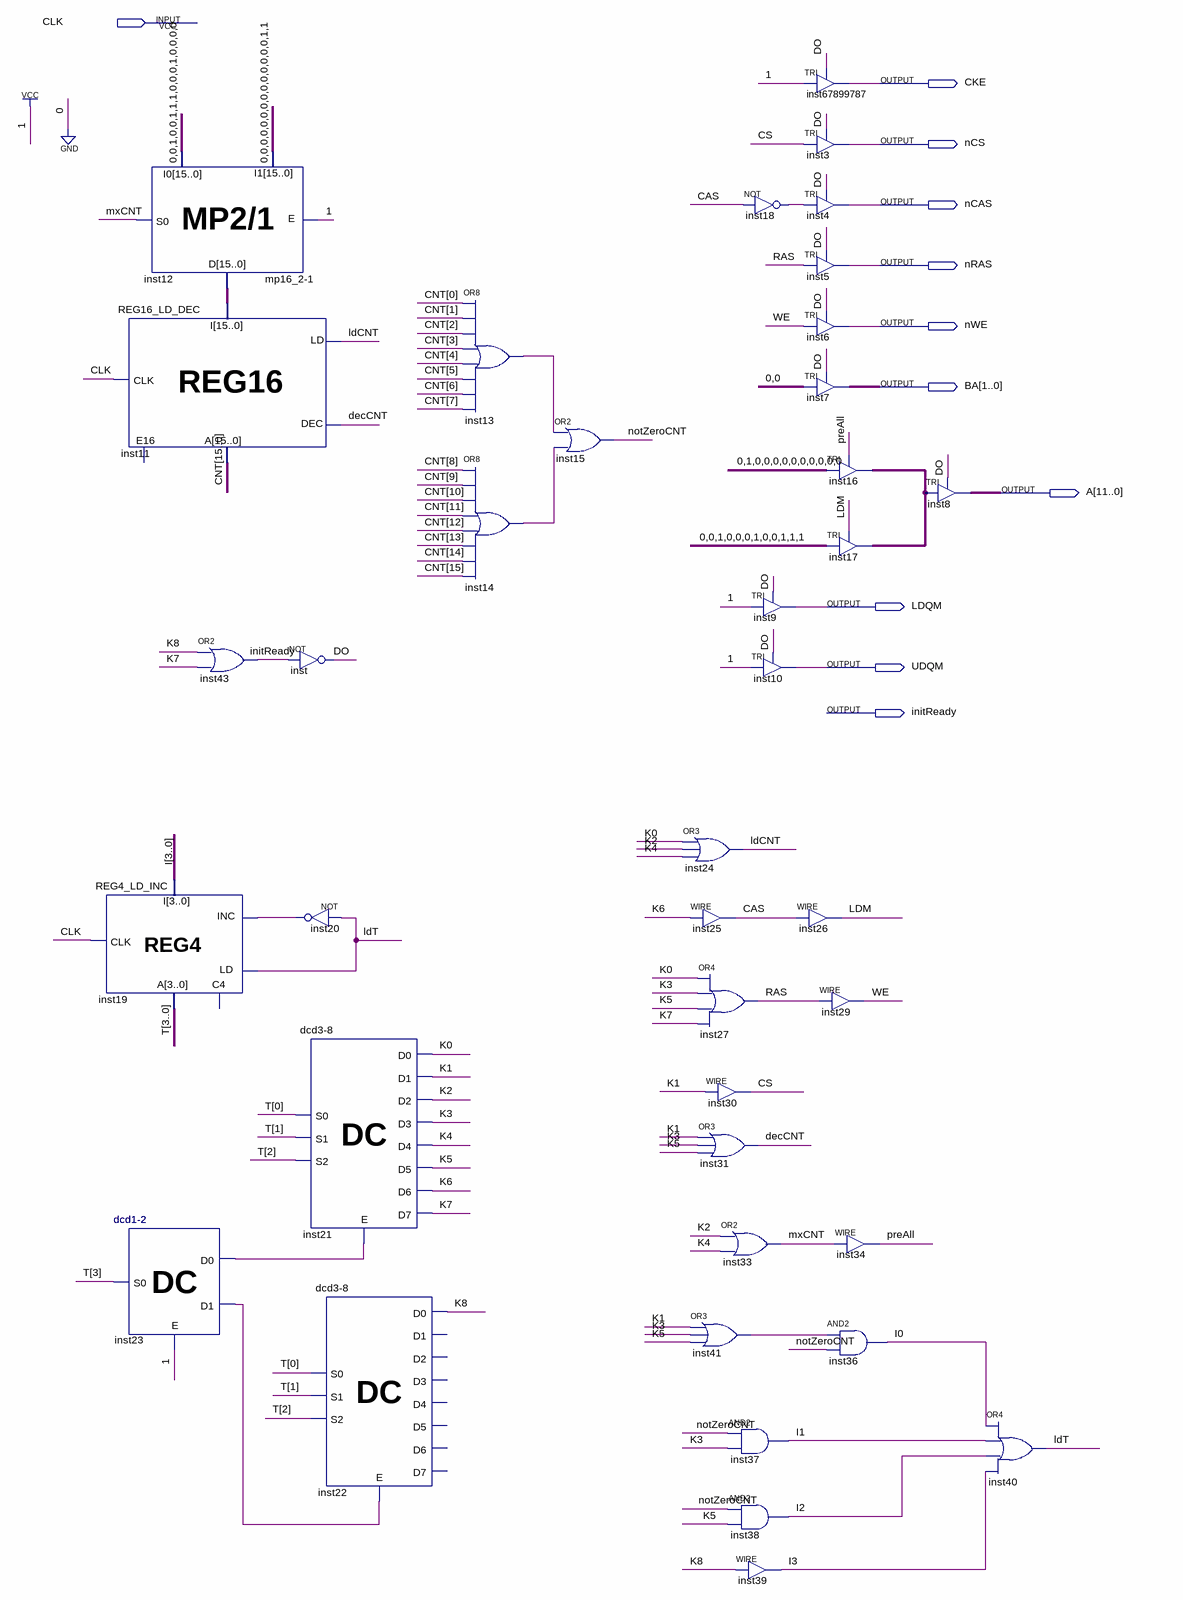
[diagram p0: schematic sheet]
// Quartus schematic GPU_init.bdf as structural Verilog: 39 symbols, 11 pins
module GPU_init (
  input  CLK,
  output CKE,
  output nCS,
  output nCAS,
  output nRAS,
  output nWE,
  output [1:0] BA,
  output [11:0] A,
  output LDQM,
  output UDQM,
  output initReady
);

  wire CAS, CS, decCNT, DO, inst13_out, inst14_out, inst18_out, inst20_out, inst23_d0, inst23_d1, inst41_out,
       K0, K1, K2, K3, K4, K5, K6, K7, K8, ldCNT, LDM, ldT, mxCNT, notZeroCNT, preAll, RAS, WE;
  wire [3:0] I, T;
  wire [11:0] inst16_out;
  wire [15:0] CNT, inst12_d;

  \mp16_2-1  inst12 (.E(1'b1), .I0(16'b0010011100010000), .I1(16'b0000000000000011), .S0(mxCNT), .D(inst12_d));
  REG16_LD_DEC inst11 (.I(inst12_d), .CLK(CLK), .LD(ldCNT), .DEC(decCNT), .A(CNT));  // open: E16
  REG4_LD_INC inst19 (.LD(ldT), .INC(inst20_out), .CLK(CLK), .I(I), .A(T));  // open: C4
  \dcd1-2  inst23 (.E(1'b1), .S0(T[3]), .D0(inst23_d0), .D1(inst23_d1));
  or inst43 (initReady, K8, K7);
  not inst (DO, initReady);
  not inst20 (inst20_out, ldT);
  \dcd3-8  inst21 (
    .E(inst23_d0), .S0(T[0]), .S1(T[1]), .S2(T[2]), .D0(K0), .D1(K1), .D2(K2), .D3(K3), .D4(K4), .D5(K5),
    .D6(K6), .D7(K7));
  \dcd3-8  inst22 (.E(inst23_d1), .S0(T[0]), .S1(T[1]), .S2(T[2]), .D0(K8));  // open: D1, D2, D3, D4, D5, D6, D7
  or inst13 (inst13_out, CNT[0], CNT[1], CNT[2], CNT[3], CNT[4], CNT[5], CNT[6], CNT[7]);
  or inst14 (inst14_out, CNT[8], CNT[9], CNT[10], CNT[11], CNT[12], CNT[13], CNT[14], CNT[15]);
  or inst15 (notZeroCNT, inst13_out, inst14_out);
  or inst24 (ldCNT, K0, K2, K4);
  not inst18 (inst18_out, CAS);
  assign CAS = K6;  // WIRE inst25
  or inst27 (RAS, K0, K3, K5, K7);
  assign CS = K1;  // WIRE inst30
  or inst31 (decCNT, K1, K3, K5);
  or inst33 (mxCNT, K2, K4);
  or inst41 (inst41_out, K1, K3, K5);
  and inst37 (I[1], notZeroCNT, K3);
  and inst38 (I[2], notZeroCNT, K5);
  assign I[3] = K8;  // WIRE inst39
  TRI inst67899787 (.IN(1'b1), .OE(DO), .OUT(CKE));
  TRI inst3 (.IN(CS), .OE(DO), .OUT(nCS));
  TRI inst4 (.IN(inst18_out), .OE(DO), .OUT(nCAS));
  TRI inst5 (.IN(RAS), .OE(DO), .OUT(nRAS));
  TRI inst6 (.IN(WE), .OE(DO), .OUT(nWE));
  TRI inst7[1:0] (.IN(2'b00), .OE(DO), .OUT(BA));
  TRI inst9 (.IN(1'b1), .OE(DO), .OUT(LDQM));
  TRI inst10 (.IN(1'b1), .OE(DO), .OUT(UDQM));
  assign LDM = CAS;  // WIRE inst26
  TRI inst16[11:0] (.IN(12'b010000000000), .OE(preAll), .OUT(inst16_out));
  TRI inst17[11:0] (.IN(12'b001000100111), .OE(LDM), .OUT(inst16_out));
  assign WE = RAS;  // WIRE inst29
  assign preAll = mxCNT;  // WIRE inst34
  and inst36 (I[0], inst41_out, notZeroCNT);
  TRI inst8[11:0] (.IN(inst16_out), .OE(DO), .OUT(A));
  or inst40 (ldT, I[0], I[1], I[2], I[3]);
endmodule
